# EAGLE schematic GTM900-breakout_v3 (EAGLE 7.7.0)
VERSION: v3
Assembly variants: default (no gps)

## Sheet 1 of 2
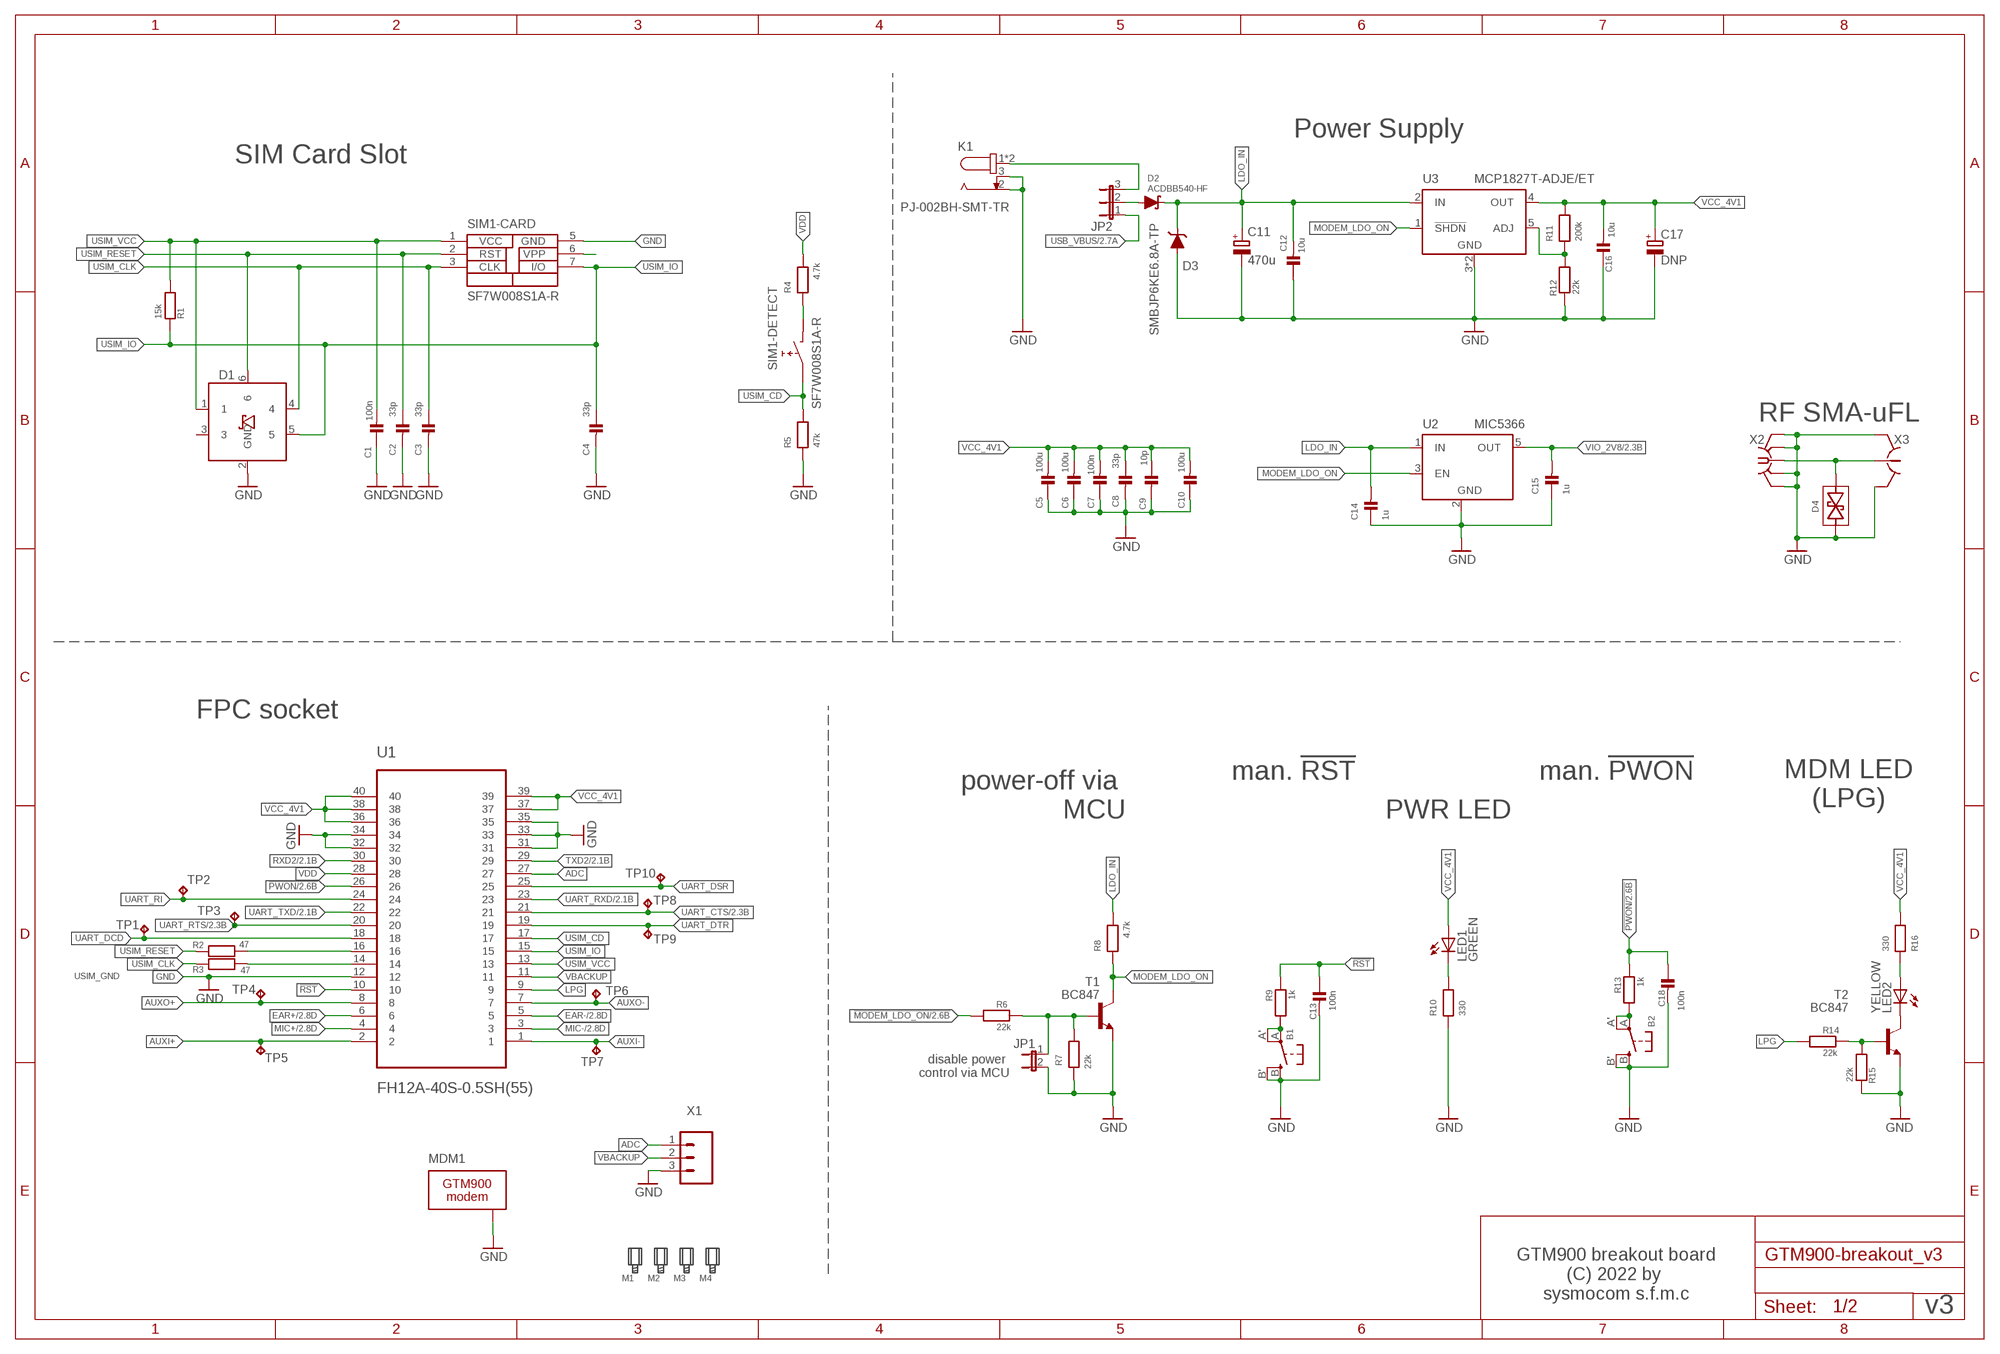
[diagram p0: schematic, sheet 1]
M1 (HEX-SPACER): CLASS: MECHANICAL; DESCRIPTION: RND STANDOFF M2X0.4 STEEL 3.5MM; LINK: https://www.digikey.de/product-detail/de/w%C3%BCrth-elektronik/9774035243R/732-7088-1-ND/; MANUFACTURER: Würth Elektronik; MANUFACTURERPARTNUMBER: 9774035243R; POPULATED: TRUE; ROHSCERTIFICATE: UNKNOWN ROHS CERTIFICATE; SCHEM_BOM_ITEM: TRUE; SOURCE: DIGIKEY; SOURCEPARTNUMBER: 732-7088-1-ND
M2 (HEX-SPACER): CLASS: MECHANICAL; DESCRIPTION: RND STANDOFF M2X0.4 STEEL 3.5MM; LINK: https://www.digikey.de/product-detail/de/w%C3%BCrth-elektronik/9774035243R/732-7088-1-ND/; MANUFACTURER: Würth Elektronik; MANUFACTURERPARTNUMBER: 9774035243R; POPULATED: TRUE; ROHSCERTIFICATE: UNKNOWN ROHS CERTIFICATE; SCHEM_BOM_ITEM: TRUE; SOURCE: DIGIKEY; SOURCEPARTNUMBER: 732-7088-1-ND
M3 (HEX-SPACER): CLASS: MECHANICAL; DESCRIPTION: RND STANDOFF M2X0.4 STEEL 3.5MM; LINK: https://www.digikey.de/product-detail/de/w%C3%BCrth-elektronik/9774035243R/732-7088-1-ND/; MANUFACTURER: Würth Elektronik; MANUFACTURERPARTNUMBER: 9774035243R; POPULATED: TRUE; ROHSCERTIFICATE: UNKNOWN ROHS CERTIFICATE; SCHEM_BOM_ITEM: TRUE; SOURCE: DIGIKEY; SOURCEPARTNUMBER: 732-7088-1-ND
M4 (HEX-SPACER): CLASS: MECHANICAL; DESCRIPTION: RND STANDOFF M2X0.4 STEEL 3.5MM; LINK: https://www.digikey.de/product-detail/de/w%C3%BCrth-elektronik/9774035243R/732-7088-1-ND/; MANUFACTURER: Würth Elektronik; MANUFACTURERPARTNUMBER: 9774035243R; POPULATED: TRUE; ROHSCERTIFICATE: UNKNOWN ROHS CERTIFICATE; SCHEM_BOM_ITEM: TRUE; SOURCE: DIGIKEY; SOURCEPARTNUMBER: 732-7088-1-ND

### Parts
B1  SWITCH_TACT_SMT  [EVQ-Q2]
B2  SWITCH_TACT_SMT  [EVQ-Q2]
C1  100n  CAP_CERAMIC_0603  [_0603]
C2  33p  CAP_CERAMIC_0402  [_0402]
C3  33p  CAP_CERAMIC_0402  [_0402]
C4  33p  CAP_CERAMIC_0402  [_0402]
C5  100u  CAP_CERAMIC1206  [1206]
C6  100u  CAP_CERAMIC1206  [1206]
C7  100n  CAP_CERAMIC_0603  [_0603]
C8  33p  CAP_CERAMIC_0402  [_0402]
C9  10p  CAP_CERAMIC_0603  [_0603]
C10  100u  CAP_CERAMIC1206  [1206]
C11  470u  CPOL-EUUD-8X10  [UD-8X10_NICHICON]
C12  10u  CAP_CERAMIC_0805  [_0805]
C13  100n  CAP_CERAMIC_0603  [_0603]
C14  1u  CAP_CERAMIC_0603  [_0603]
C15  1u  CAP_CERAMIC_0603  [_0603]
C16  10u  CAP_CERAMIC_0805  [_0805]
C17  DNP  CPOL-EUSMCE  [SMC_E]
C18  100n  CAP_CERAMIC_0603  [_0603]
D1  PESD5V0UBV  [SOT666]
D2  ACDBB540-HF  DIODE-SCHOTTKY-SMB  [SMBDIODE]
D3  SMBJP6KE6.8A-TP  DIODE-TVS-SMB  [SMBDIODE]
D4  GG040205170N2P  TVSDIODE-BIDI-0402  [_0402]
JP1  JP1E  [JP1]
JP2  JP2E  [JP2]
K1  PJ-002BH-SMT-TR  694108106102  [694108106102]
LED1  GREEN  LEDCHIP-LED0603  [CHIP-LED0603]
LED2  YELLOW  LEDCHIP-LED0603  [CHIP-LED0603]
MDM1  GTM900-BM2-SPACER  [GTM900-WRTHSPACER]
R1  15k  RESISTOR_0603  [_0603]
R2  47  RESISTOR_0603  [_0603]
R3  47  RESISTOR_0603  [_0603]
R4  4.7k  RESISTOR_0603  [_0603]
R5  47k  RESISTOR_0603  [_0603]
R6  22k  RESISTOR_0603  [_0603]
R7  22k  RESISTOR_0603  [_0603]
R8  4.7k  RESISTOR_0603  [_0603]
R9  1k  RESISTOR_0603  [_0603]
R10  330  RESISTOR_0603  [_0603]
R11  200k  RESISTOR_0603  [_0603]
R12  22k  RESISTOR_0603  [_0603]
R13  1k  RESISTOR_0603  [_0603]
R14  22k  RESISTOR_0603  [_0603]
R15  22k  RESISTOR_0603  [_0603]
R16  330  RESISTOR_0603  [_0603]
SIM1  SF7W008S1A-R  [SF7W008S1A-RESTR]
T1  BC847  BC847C-NPN-SOT23-BEC  [SOT23-BEC]
T2  BC847  BC847C-NPN-SOT23-BEC  [SOT23-BEC]
TP1  TPTP10R  [TP10R]
TP2  TPTP10R  [TP10R]
TP3  TPTP10R  [TP10R]
TP4  TPTP10R  [TP10R]
TP5  TPTP10R  [TP10R]
TP6  TPTP10R  [TP10R]
TP7  TPTP10R  [TP10R]
TP8  TPTP10R  [TP10R]
TP9  TPTP10R  [TP10R]
TP10  TPTP10R  [TP10R]
U1  FH12A-40S-0.5SH(55)  [HIROSE_FH12A-40S-0.5SH(55)]
U2  MIC5366  LDO_FIXED_EN-MIC5365-YC5  [SC70-5]
U3  MCP1827T-ADJE/ET  LDO_SHD_ADJMCP1827T-ADJE/ET  [TI_KTT_DPAK2]
X1  PINHD-1X3PTH  [1X03]
X2  SMA-F-S-TH  [SMA-F-S-TH]
X3  HRS_UFL  [HRS_UFL]

### Nets
!MODEM_LDO_ON: R6.1 ; also sheet 2
!PWON: C18.1 R13.1 U1.26 ; also sheet 2
!RST: C13.1 R9.1 U1.10
_USIM_CLK: R3.1 U1.14
_USIM_RESET: R2.1 U1.16
ADC: U1.27 X1.1
AUXI+: TP5.TP U1.2
AUXI-: TP7.TP U1.1
AUXO+: TP4.TP U1.8
AUXO-: TP6.TP U1.7
EAR+: U1.6 ; also sheet 2
EAR-: U1.5 ; also sheet 2
GND [supply]: B1.B'(S1) B1.B(S) B2.B'(S1) B2.B(S) C1.1 C2.2 C3.2 C4.2 C5.1 C6.1 C7.1 C8.2 C9.2 C10.1 C11.- C12.1 C13.2 C14.1 C15.1 C16.1 C17.- C18.2 D1.2(GND) D3.A D4.1 JP1.2 K1.2 K1.3 MDM1.1 MDM1.2 MDM1.3 MDM1.4 R5.1 R7.2 R10.1 R12.2 R15.2 SIM1.5(-CARD:GND) T1.E T2.E U1.12 U1.31 U1.32 U1.33 U1.34 U1.35 U2.2(GND) U3.3(GND) U3.PAD(GND) X1.3 X2.G1(GND) X2.G2(GND) X2.G3(GND) X2.G4(GND) X3.GND@1(GND) X3.GND@2(GND) ; also sheet 2
LDO_IN [supply]: C11.+ C12.2 C14.2 D2.C D3.C R8.2 U2.1(IN) U3.2(IN)
LPG: R14.1 U1.9
MIC+: U1.4 ; also sheet 2
MIC-: U1.3 ; also sheet 2
MODEM_LDO_ON: R8.1 T1.C U2.3(EN) U3.1(!SHDN)
N$1: LED1.C R10.2
N$2: LED2.A R16.2
N$3: LED2.C T2.C
N$4 [supply]: JP2.3 K1.1 K1.1-1
N$5: R14.2 R15.1 T2.B
N$6: R11.1 R12.1 U3.5(ADJ)
N$9: B2.A'(P1) B2.A(P) R13.2
N$10: R4.1 SIM1.82
N$13 [50 ohm]: D4.2 X2.C X3.SIG
N$17: JP1.1 R6.2 R7.1 T1.B
N$19 [supply]: D2.A JP2.2
N$21: B1.A'(P1) B1.A(P) R9.2
RXD2: U1.30 ; also sheet 2
TXD2: U1.29 ; also sheet 2
UART_CTS: TP8.TP U1.21 ; also sheet 2
UART_DCD: TP1.TP U1.18
UART_DSR: TP10.TP U1.25
UART_DTR: TP9.TP U1.19
UART_RI: TP2.TP U1.24
UART_RTS: TP3.TP U1.20 ; also sheet 2
UART_RXD: U1.23 ; also sheet 2
UART_TXD: U1.22 ; also sheet 2
USB_VBUS [supply]: JP2.1 ; also sheet 2
USIM_CD: R5.2 SIM1.81 U1.17
USIM_CLK: C3.1 D1.4 R3.2 SIM1.3(-CARD:CLK)
USIM_IO: C4.1 D1.5 R1.1 SIM1.7(-CARD:I/O) U1.15
USIM_RESET: C2.1 D1.6 R2.2 SIM1.2(-CARD:RST)
USIM_VCC [supply]: C1.2 D1.1 R1.2 SIM1.1(-CARD:VCC) U1.13
USIM_VPP: SIM1.6(-CARD:VPP)
VBACKUP: U1.11 X1.2
VCC_4V1 [supply]: C5.2 C6.2 C7.2 C8.1 C9.1 C10.2 C16.2 C17.+ LED1.A R11.2 R16.1 U1.36 U1.37 U1.38 U1.39 U1.40 U3.4(OUT)
VDD: R4.2 U1.28
VIO_2V8: C15.2 U2.5(OUT) ; also sheet 2
Unconnected: D1.3

### Notes on the sheet
- Power Supply
- SIM Card Slot
- RF SMA-uFL
- FPC socket
- power-off via 
  MCU
- man. !RST | man. !PWON
- MDM LED
  (LPG)
- PWR LED
- USIM_GND
- disable power 
  control via MCU
- GTM900 breakout board
  (C) 2022 by 
  sysmocom s.f.m.c

## Sheet 2 of 2
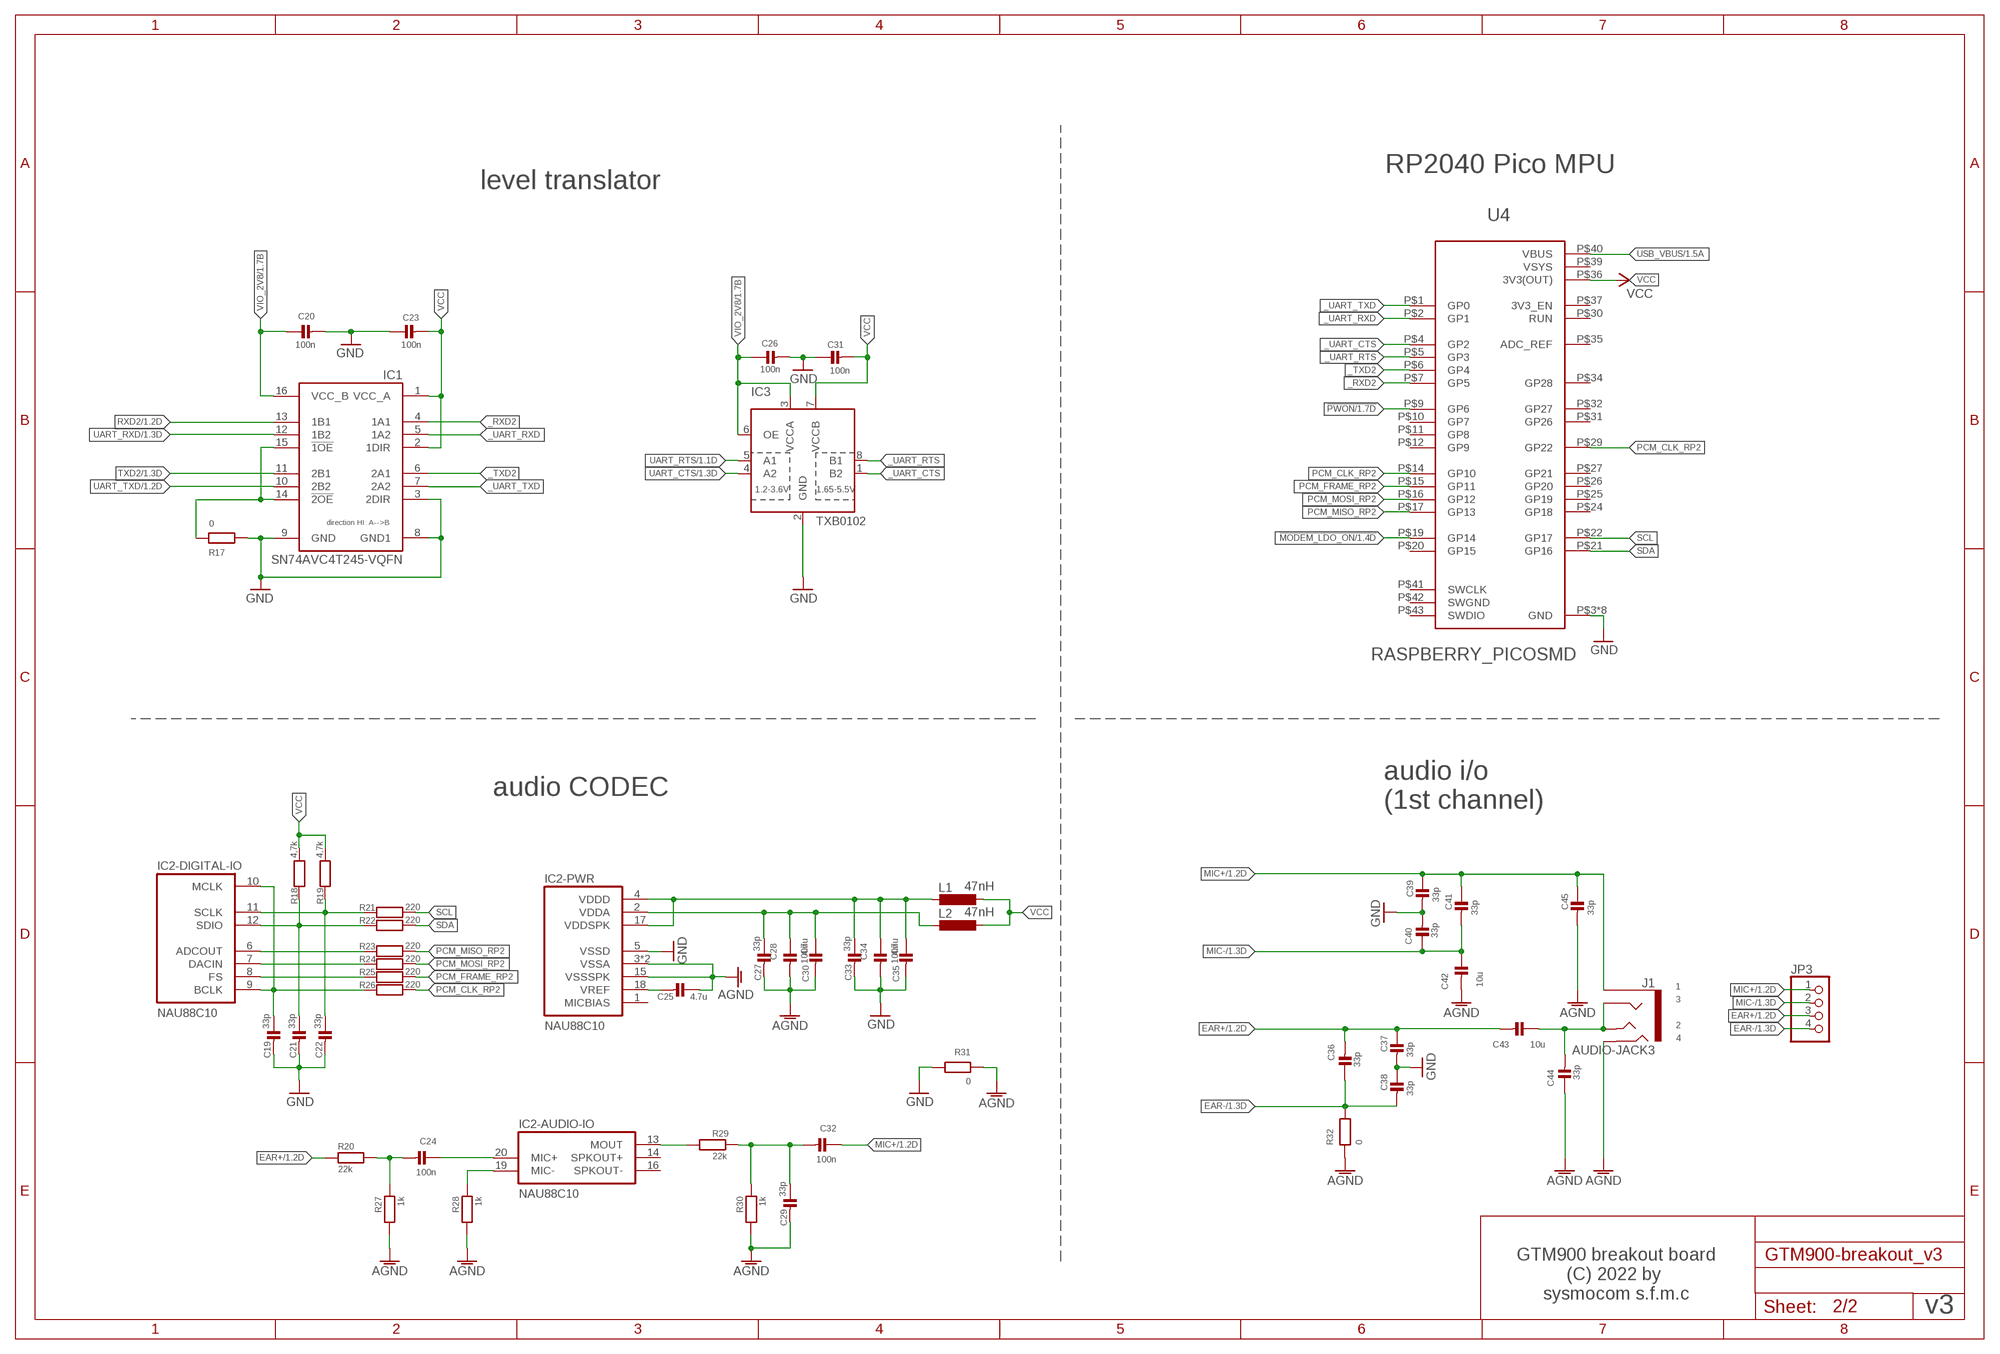
[diagram p1: schematic, sheet 2]

### Parts
C19  33p  CAP_CERAMIC_0402  [_0402]
C20  100n  CAP_CERAMIC_0603  [_0603]
C21  33p  CAP_CERAMIC_0402  [_0402]
C22  33p  CAP_CERAMIC_0402  [_0402]
C23  100n  CAP_CERAMIC_0603  [_0603]
C24  100n  CAP_CERAMIC_0603  [_0603]
C25  4.7u  CAP_CERAMIC_0603  [_0603]
C26  100n  CAP_CERAMIC_0603  [_0603]
C27  33p  CAP_CERAMIC_0402  [_0402]
C28  100n  CAP_CERAMIC_0603  [_0603]
C29  33p  CAP_CERAMIC_0402  [_0402]
C30  4.7u  CAP_CERAMIC_0603  [_0603]
C31  100n  CAP_CERAMIC_0603  [_0603]
C32  100n  CAP_CERAMIC_0603  [_0603]
C33  33p  CAP_CERAMIC_0402  [_0402]
C34  100n  CAP_CERAMIC_0603  [_0603]
C35  4.7u  CAP_CERAMIC_0603  [_0603]
C36  33p  CAP_CERAMIC_0402  [_0402]
C37  33p  CAP_CERAMIC_0402  [_0402]
C38  33p  CAP_CERAMIC_0402  [_0402]
C39  33p  CAP_CERAMIC_0402  [_0402]
C40  33p  CAP_CERAMIC_0402  [_0402]
C41  33p  CAP_CERAMIC_0402  [_0402]
C42  10u  CAP_CERAMIC_0805  [_0805]
C43  10u  CAP_CERAMIC_0805  [_0805]
C44  33p  CAP_CERAMIC_0402  [_0402]
C45  33p  CAP_CERAMIC_0402  [_0402]
IC1  SN74AVC4T245-VQFN  [VQFN-N16]
IC2  NAU88C10  [QFN20]
IC3  TXB0102  [VSSOP-8]
J1  AUDIO-JACK3  [AUDIO-JACK-TRRS-SMD]
JP3  HEADER-1X476MIL  [1X04_ROUND_76]
L1  47nH  INDUCTOR_0603  [_0603]
L2  47nH  INDUCTOR_0603  [_0603]
R17  0  RESISTOR_0603  [_0603]
R18  4,7k  RESISTOR_0603  [_0603]
R19  4,7k  RESISTOR_0603  [_0603]
R20  22k  RESISTOR_0603  [_0603]
R21  220  RESISTOR_0603  [_0603]
R22  220  RESISTOR_0603  [_0603]
R23  220  RESISTOR_0603  [_0603]
R24  220  RESISTOR_0603  [_0603]
R25  220  RESISTOR_0603  [_0603]
R26  220  RESISTOR_0603  [_0603]
R27  1k  RESISTOR_0603  [_0603]
R28  1k  RESISTOR_0603  [_0603]
R29  22k  RESISTOR_0603  [_0603]
R30  1k  RESISTOR_0603  [_0603]
R31  0  RESISTOR_0603  [_0603]
R32  0  RESISTOR_0603  [_0603]
U4  RASPBERRY_PICOSMD  [PICO-PKG-SMD]

### Nets
!MODEM_LDO_ON: U4.P$19(GP14) ; also sheet 1
!PWON: U4.P$9(GP6) ; also sheet 1
_RXD2: IC1.4(1A1) U4.P$7(GP5)
_TXD2: IC1.6(2A1) U4.P$6(GP4)
_UART_CTS: IC3.1(B2) U4.P$4(GP2)
_UART_RTS: IC3.8(B1) U4.P$5(GP3)
_UART_RXD: IC1.5(1A2) U4.P$2(GP1)
_UART_TXD: IC1.7(2A2) U4.P$1(GP0)
AGND: C25.1 C27.2 C28.2 C29.2 C30.2 C42.2 C44.1 C45.2 IC2.3(-PWR:VSSA) IC2.15(-PWR:VSSSPK) IC2.EXP(-PWR:VSSA) J1.4(RING2) R27.2 R28.2 R30.2 R31.1 R32.1
EAR+: C36.2 C37.1 C43.2 JP3.3 R20.1 ; also sheet 1
EAR-: C36.1 C38.2 JP3.4 R32.2 ; also sheet 1
GND [supply]: C19.2 C20.2 C21.2 C22.2 C23.1 C26.2 C31.1 C33.2 C34.2 C35.2 C37.2 C38.1 C39.2 C40.2 IC1.3(2DIR) IC1.8(GND1) IC1.9(GND) IC2.5(-PWR:VSSD) IC3.2(GND) R17.2 R31.2 U4.P$3(GND) U4.P$8(GND) U4.P$13(GND) U4.P$18(GND) U4.P$23(GND) U4.P$28(GND) U4.P$33(GND) U4.P$38(GND) ; also sheet 1
MIC+: C32.1 C39.1 C41.1 C45.1 J1.1(EARTH) JP3.1 ; also sheet 1
MIC-: C40.1 C41.2 C42.1 JP3.2 ; also sheet 1
N$7: C24.2 R20.2 R27.1
N$8: C43.1 C44.2 J1.2(TIP) J1.3(RING1)
N$11: C19.1 IC2.9(-DIGITAL-IO:BCLK) IC2.10(-DIGITAL-IO:MCLK) R26.1
N$12: IC2.8(-DIGITAL-IO:FS) R25.1
N$14: IC2.7(-DIGITAL-IO:DACIN) R24.1
N$15: IC2.6(-DIGITAL-IO:ADCOUT) R23.1
N$16: C29.1 C32.2 R29.2 R30.1
N$18: IC2.19(-AUDIO-IO:MIC-) R28.1
N$20: C33.1 C34.1 C35.1 IC2.4(-PWR:VDDD) IC2.17(-PWR:VDDSPK) L1.2
N$22 [supply]: IC1.14(!2OE) IC1.15(!1OE) R17.1
N$24: C27.1 C28.1 C30.1 IC2.2(-PWR:VDDA) L2.2
N$25: C21.1 IC2.12(-DIGITAL-IO:SDIO) R18.1 R22.1
N$26: C22.1 IC2.11(-DIGITAL-IO:SCLK) R19.1 R21.1
N$28: C25.2 IC2.18(-PWR:VREF)
N$30: IC2.13(-AUDIO-IO:MOUT) R29.1
N$31: C24.1 IC2.20(-AUDIO-IO:MIC+)
PCM_CLK_RP2: R26.2 U4.P$14(GP10) U4.P$29(GP22)
PCM_FRAME_RP2: R25.2 U4.P$15(GP11)
PCM_MISO_RP2: R23.2 U4.P$17(GP13)
PCM_MOSI_RP2: R24.2 U4.P$16(GP12)
RXD2: IC1.13(1B1) ; also sheet 1
SCL: R21.2 U4.P$22(GP17)
SDA: R22.2 U4.P$21(GP16)
TXD2: IC1.11(2B1) ; also sheet 1
UART_CTS: IC3.4(A2) ; also sheet 1
UART_RTS: IC3.5(A1) ; also sheet 1
UART_RXD: IC1.12(1B2) ; also sheet 1
UART_TXD: IC1.10(2B2) ; also sheet 1
USB_VBUS [supply]: U4.P$40(VBUS) ; also sheet 1
VCC: C23.2 C31.2 IC1.1(VCC_A) IC1.2(1DIR) IC3.7(VCCB) L1.1 L2.1 R18.2 R19.2 U4.P$36(3V3(OUT))
VIO_2V8: C20.1 C26.1 IC1.16(VCC_B) IC3.3(VCCA) IC3.6(OE) ; also sheet 1
Unconnected: U4.P$10(GP7) U4.P$11(GP8) U4.P$12(GP9) U4.P$20(GP15) U4.P$24(GP18) U4.P$25(GP19) U4.P$26(GP20) U4.P$27(GP21) U4.P$30(RUN) U4.P$31(GP26) U4.P$32(GP27) U4.P$34(GP28) U4.P$35(ADC_REF) U4.P$37(3V3_EN) U4.P$41(SWCLK) U4.P$43(SWDIO)

### Notes on the sheet
- RP2040 Pico MPU
- level translator
- audio CODEC
- audio i/o 
  (1st channel)
- GTM900 breakout board
  (C) 2022 by 
  sysmocom s.f.m.c

## Power pins joined to a net without a drawn wire
MICBIAS: IC2.1(-PWR:MICBIAS)
SPKOUT+: IC2.14(-AUDIO-IO:SPKOUT+)
SPKOUT-: IC2.16(-AUDIO-IO:SPKOUT-)
SWGND: U4.P$42(SWGND)
VSYS: U4.P$39(VSYS)

## Library data of the parts
B1 B2 = microbuilder:SWITCH_TACT_SMT: SMT Tact Switches 6x6mm - Digikey: P12940SCT-ND KMR2 (4.6x2.8mm) - Digikey: 401-1426-1-ND EVQ-PQHB55 - Light Touch, 160GF (4.5x4.5mm) - Digikey: P8090SCT-ND; CLASS: TACT SWITCH; DESCRIPTION: SWITCH TACTILE SPST-NO 0.02A 15V; LINK: https://www.digikey.de/product-detail/de/panasonic-electronic-components/EVQ-Q2M03W/P12946SCT-ND; MANUFACTURER: Panasonic Electronic Components; MANUFACTURERPARTNUMBER: EVQ-Q2M03W; POPULATED: TRUE; ROHSCERTIFICATE: UNKNOWN ROHS CERTIFICATE; SOURCE: DIGIKEY; SOURCEPARTNUMBER: P12946SCT-ND
C1 C7 C13 C18 = rc-sysmocom:CAP_CERAMIC: Ceramic Capacitors 0402 - 0402 Surface Mount Capacitors 16pF 50V 5% [Digikey: 445-4899-2-ND] 18pF 50V 5% [Digikey: 490-1281-2-ND] 22pF 50V 5% [Digikey: 490-1283-2-ND] 68pF 50V 5% [Digikey: 490-1289-2-ND] 0.1uF 10V 10% [Digikey: 490-1318-2-ND] 1.0uF 6.3V 10% [Digikey: 490-1320-2-ND] 0603 - 0603 Surface Mount Capacitors 16 pF 50V 5% [Digikey: 445-5051-2-ND] 22 pF 50V [Digikey: PCC220ACVTR-ND] 33 pF 50V 5% [Digikey: 490-1415-1-ND] 56pF 50V 5% [Digikey: 490-1421-1-ND] 220pF 50V 5% [Digikey: 445-1285-1-ND] 680 pF 50V 2200 pF 50V 5% C0G [Digikey: 445-1297-1-ND] 5600 pF 100V 5% X7R [Digikey: 478-3711-1-ND] 0.1 µF 25V 10% [Digikey: PCC2277TR-ND] 0.22 µF 16V 10% X7R [Digikey: 445-1318-1-ND] 1.0 µF 25V 10% [Digikey: 445-5146-2-ND] 0603 - RF Specific 3pF 250V +/-0.1pF RF [Digikey: 712-1347-1-ND] 18 pF 250V 5% [Digikey: 478-3505-1-ND or 712-1322-1-ND] 56 pF 250V 5% C0G RF [Digikey: 490-4867-1-ND] 68 pF 250V RF [Digikey: 490-4868-1-ND] 0805 - 0805 Surface Mount Capacitors 220 pF 250V 2% RF Ceramic Capacitor [Digikey: 712-1398-1-ND] 1000 pF 50V 2% NP0 Ceramic Capacitor [Digikey: 478-3760-1-ND] 0.1 µF 25V 10% Ceramic Capacitor [Digikey: PCC1828TR-ND] 1.0 µF 16V 10% Ceramic Capacitor[Digikey: 490-1691-2-ND] 10.0 µF 10V 10% Ceramic Capacitor[Digikey: 709-1228-1-ND] 10.0 uF 16V 10% Ceramic Capacitor [Digikey: 478-5165-2-ND] 47 uF 6.3V 20% Ceramic Capacitor [Digikey: 587-1779-1-ND or 399-5506-1-ND] 1206 - 1206 Surface Mount Capacitors 47uF 10V 20% Ceramic Capacitor [Digikey: 490-5528-1-ND or 399-5508-1-ND or 445-6010-1-ND] 100uF 6.3V -20%, +80% Y5V Ceramic Capacitor (Digikey: 490-4512-1-ND, Mouser: 81-GRM31CF50J107ZE1L) 1810 - 1810 Surface Mount Capacitors High volt MLC; no solder stop between for higher isolation; CLASS: CAPACITOR; DESCRIPTION: CAP CER 0.1UF 16V 10% X7R 0603; LINK: http://www.digikey.de/product-detail/de/foo/1276-1005-1-ND; MANUFACTURER: Samsung Electro-Mechanics America, Inc; MANUFACTURERPARTNUMBER: CL10B104KO8NNNC; POPULATED: TRUE; ROHSCERTIFICATE: Bleifrei / RoHS-konform; SOURCE: DIGIKEY; SOURCEPARTNUMBER: 1276-1005-1-ND
C2-C4 C8 C19 C21 C22 C27 C29 C33 C36-C41 C44 C45 = rc-sysmocom:CAP_CERAMIC: Ceramic Capacitors 0402 - 0402 Surface Mount Capacitors 16pF 50V 5% [Digikey: 445-4899-2-ND] 18pF 50V 5% [Digikey: 490-1281-2-ND] 22pF 50V 5% [Digikey: 490-1283-2-ND] 68pF 50V 5% [Digikey: 490-1289-2-ND] 0.1uF 10V 10% [Digikey: 490-1318-2-ND] 1.0uF 6.3V 10% [Digikey: 490-1320-2-ND] 0603 - 0603 Surface Mount Capacitors 16 pF 50V 5% [Digikey: 445-5051-2-ND] 22 pF 50V [Digikey: PCC220ACVTR-ND] 33 pF 50V 5% [Digikey: 490-1415-1-ND] 56pF 50V 5% [Digikey: 490-1421-1-ND] 220pF 50V 5% [Digikey: 445-1285-1-ND] 680 pF 50V 2200 pF 50V 5% C0G [Digikey: 445-1297-1-ND] 5600 pF 100V 5% X7R [Digikey: 478-3711-1-ND] 0.1 µF 25V 10% [Digikey: PCC2277TR-ND] 0.22 µF 16V 10% X7R [Digikey: 445-1318-1-ND] 1.0 µF 25V 10% [Digikey: 445-5146-2-ND] 0603 - RF Specific 3pF 250V +/-0.1pF RF [Digikey: 712-1347-1-ND] 18 pF 250V 5% [Digikey: 478-3505-1-ND or 712-1322-1-ND] 56 pF 250V 5% C0G RF [Digikey: 490-4867-1-ND] 68 pF 250V RF [Digikey: 490-4868-1-ND] 0805 - 0805 Surface Mount Capacitors 220 pF 250V 2% RF Ceramic Capacitor [Digikey: 712-1398-1-ND] 1000 pF 50V 2% NP0 Ceramic Capacitor [Digikey: 478-3760-1-ND] 0.1 µF 25V 10% Ceramic Capacitor [Digikey: PCC1828TR-ND] 1.0 µF 16V 10% Ceramic Capacitor[Digikey: 490-1691-2-ND] 10.0 µF 10V 10% Ceramic Capacitor[Digikey: 709-1228-1-ND] 10.0 uF 16V 10% Ceramic Capacitor [Digikey: 478-5165-2-ND] 47 uF 6.3V 20% Ceramic Capacitor [Digikey: 587-1779-1-ND or 399-5506-1-ND] 1206 - 1206 Surface Mount Capacitors 47uF 10V 20% Ceramic Capacitor [Digikey: 490-5528-1-ND or 399-5508-1-ND or 445-6010-1-ND] 100uF 6.3V -20%, +80% Y5V Ceramic Capacitor (Digikey: 490-4512-1-ND, Mouser: 81-GRM31CF50J107ZE1L) 1810 - 1810 Surface Mount Capacitors High volt MLC; no solder stop between for higher isolation; CLASS: CAPACITOR; DESCRIPTION: CAP CER 33PF 50V NP0 0402; LINK: http://www.digikey.de/product-detail/de/CL05C330JB5NNNC/1276-1272-1-ND/3889358; MANUFACTURER: Samsung Electro-Mechanics America, Inc.; MANUFACTURERPARTNUMBER: CL05C330JB5NNNC; POPULATED: TRUE; ROHSCERTIFICATE: Bleifrei / RoHS-konform; SOURCE: DIGIKEY; SOURCEPARTNUMBER: 1276-1272-1-ND
C5 C6 C10 = rc-sysmocom:CAP_CERAMIC: Ceramic Capacitors 0402 - 0402 Surface Mount Capacitors 16pF 50V 5% [Digikey: 445-4899-2-ND] 18pF 50V 5% [Digikey: 490-1281-2-ND] 22pF 50V 5% [Digikey: 490-1283-2-ND] 68pF 50V 5% [Digikey: 490-1289-2-ND] 0.1uF 10V 10% [Digikey: 490-1318-2-ND] 1.0uF 6.3V 10% [Digikey: 490-1320-2-ND] 0603 - 0603 Surface Mount Capacitors 16 pF 50V 5% [Digikey: 445-5051-2-ND] 22 pF 50V [Digikey: PCC220ACVTR-ND] 33 pF 50V 5% [Digikey: 490-1415-1-ND] 56pF 50V 5% [Digikey: 490-1421-1-ND] 220pF 50V 5% [Digikey: 445-1285-1-ND] 680 pF 50V 2200 pF 50V 5% C0G [Digikey: 445-1297-1-ND] 5600 pF 100V 5% X7R [Digikey: 478-3711-1-ND] 0.1 µF 25V 10% [Digikey: PCC2277TR-ND] 0.22 µF 16V 10% X7R [Digikey: 445-1318-1-ND] 1.0 µF 25V 10% [Digikey: 445-5146-2-ND] 0603 - RF Specific 3pF 250V +/-0.1pF RF [Digikey: 712-1347-1-ND] 18 pF 250V 5% [Digikey: 478-3505-1-ND or 712-1322-1-ND] 56 pF 250V 5% C0G RF [Digikey: 490-4867-1-ND] 68 pF 250V RF [Digikey: 490-4868-1-ND] 0805 - 0805 Surface Mount Capacitors 220 pF 250V 2% RF Ceramic Capacitor [Digikey: 712-1398-1-ND] 1000 pF 50V 2% NP0 Ceramic Capacitor [Digikey: 478-3760-1-ND] 0.1 µF 25V 10% Ceramic Capacitor [Digikey: PCC1828TR-ND] 1.0 µF 16V 10% Ceramic Capacitor[Digikey: 490-1691-2-ND] 10.0 µF 10V 10% Ceramic Capacitor[Digikey: 709-1228-1-ND] 10.0 uF 16V 10% Ceramic Capacitor [Digikey: 478-5165-2-ND] 47 uF 6.3V 20% Ceramic Capacitor [Digikey: 587-1779-1-ND or 399-5506-1-ND] 1206 - 1206 Surface Mount Capacitors 47uF 10V 20% Ceramic Capacitor [Digikey: 490-5528-1-ND or 399-5508-1-ND or 445-6010-1-ND] 100uF 6.3V -20%, +80% Y5V Ceramic Capacitor (Digikey: 490-4512-1-ND, Mouser: 81-GRM31CF50J107ZE1L) 1810 - 1810 Surface Mount Capacitors High volt MLC; no solder stop between for higher isolation; CLASS: CAPACITOR; DESCRIPTION: CAP CER 100UF 6.3V X5R 1206; LINK: http://www.digikey.de/product-detail/de/murata-electronics-north-america/GRM31CR60J107ME39K/490-7217-1-ND/3991203; MANUFACTURER: Murata Electronics; MANUFACTURERPARTNUMBER: GRM31CR60J107ME39K; POPULATED: TRUE; ROHSCERTIFICATE: UNKNOWN ROHS CERTIFICATE; SOURCE: DIGIKEY; SOURCEPARTNUMBER: 490-7217-1-ND
C9 = rc-sysmocom:CAP_CERAMIC: Ceramic Capacitors 0402 - 0402 Surface Mount Capacitors 16pF 50V 5% [Digikey: 445-4899-2-ND] 18pF 50V 5% [Digikey: 490-1281-2-ND] 22pF 50V 5% [Digikey: 490-1283-2-ND] 68pF 50V 5% [Digikey: 490-1289-2-ND] 0.1uF 10V 10% [Digikey: 490-1318-2-ND] 1.0uF 6.3V 10% [Digikey: 490-1320-2-ND] 0603 - 0603 Surface Mount Capacitors 16 pF 50V 5% [Digikey: 445-5051-2-ND] 22 pF 50V [Digikey: PCC220ACVTR-ND] 33 pF 50V 5% [Digikey: 490-1415-1-ND] 56pF 50V 5% [Digikey: 490-1421-1-ND] 220pF 50V 5% [Digikey: 445-1285-1-ND] 680 pF 50V 2200 pF 50V 5% C0G [Digikey: 445-1297-1-ND] 5600 pF 100V 5% X7R [Digikey: 478-3711-1-ND] 0.1 µF 25V 10% [Digikey: PCC2277TR-ND] 0.22 µF 16V 10% X7R [Digikey: 445-1318-1-ND] 1.0 µF 25V 10% [Digikey: 445-5146-2-ND] 0603 - RF Specific 3pF 250V +/-0.1pF RF [Digikey: 712-1347-1-ND] 18 pF 250V 5% [Digikey: 478-3505-1-ND or 712-1322-1-ND] 56 pF 250V 5% C0G RF [Digikey: 490-4867-1-ND] 68 pF 250V RF [Digikey: 490-4868-1-ND] 0805 - 0805 Surface Mount Capacitors 220 pF 250V 2% RF Ceramic Capacitor [Digikey: 712-1398-1-ND] 1000 pF 50V 2% NP0 Ceramic Capacitor [Digikey: 478-3760-1-ND] 0.1 µF 25V 10% Ceramic Capacitor [Digikey: PCC1828TR-ND] 1.0 µF 16V 10% Ceramic Capacitor[Digikey: 490-1691-2-ND] 10.0 µF 10V 10% Ceramic Capacitor[Digikey: 709-1228-1-ND] 10.0 uF 16V 10% Ceramic Capacitor [Digikey: 478-5165-2-ND] 47 uF 6.3V 20% Ceramic Capacitor [Digikey: 587-1779-1-ND or 399-5506-1-ND] 1206 - 1206 Surface Mount Capacitors 47uF 10V 20% Ceramic Capacitor [Digikey: 490-5528-1-ND or 399-5508-1-ND or 445-6010-1-ND] 100uF 6.3V -20%, +80% Y5V Ceramic Capacitor (Digikey: 490-4512-1-ND, Mouser: 81-GRM31CF50J107ZE1L) 1810 - 1810 Surface Mount Capacitors High volt MLC; no solder stop between for higher isolation; CLASS: CAPACITOR; DESCRIPTION: CAP CER 10PF 50V NP0 0603; LINK: http://www.digikey.de/product-detail/de/C0603C100J5GACTU/399-1049-1-ND; MANUFACTURER: Kemet; MANUFACTURERPARTNUMBER: C0603C100J5GACTU; POPULATED: TRUE; ROHSCERTIFICATE: Bleifrei / RoHS-konform; SOURCE: DIGIKEY; SOURCEPARTNUMBER: 399-1049-1-ND
C11 = rcl:CPOL-EU: POLARIZED CAPACITOR, European symbol; CLASS: CAPACITOR; DESCRIPTION: CAP ALUM 470UF 20%% 6.3V SMD; LINK: http://www.digikey.de/product-detail/de/nichicon/UUR0J471MNL1GS/493-6207-1-ND/3438720; MANUFACTURER: Nichicon; MANUFACTURERPARTNUMBER: UUR0J471MNL1GS; POPULATED: TRUE; ROHSCERTIFICATE: UNKNOWN ROHS CERTIFICATE; SOURCE: DIGIKEY; SOURCEPARTNUMBER: 493-6207-1-ND
C12 C16 C42 C43 = rc-sysmocom:CAP_CERAMIC: Ceramic Capacitors 0402 - 0402 Surface Mount Capacitors 16pF 50V 5% [Digikey: 445-4899-2-ND] 18pF 50V 5% [Digikey: 490-1281-2-ND] 22pF 50V 5% [Digikey: 490-1283-2-ND] 68pF 50V 5% [Digikey: 490-1289-2-ND] 0.1uF 10V 10% [Digikey: 490-1318-2-ND] 1.0uF 6.3V 10% [Digikey: 490-1320-2-ND] 0603 - 0603 Surface Mount Capacitors 16 pF 50V 5% [Digikey: 445-5051-2-ND] 22 pF 50V [Digikey: PCC220ACVTR-ND] 33 pF 50V 5% [Digikey: 490-1415-1-ND] 56pF 50V 5% [Digikey: 490-1421-1-ND] 220pF 50V 5% [Digikey: 445-1285-1-ND] 680 pF 50V 2200 pF 50V 5% C0G [Digikey: 445-1297-1-ND] 5600 pF 100V 5% X7R [Digikey: 478-3711-1-ND] 0.1 µF 25V 10% [Digikey: PCC2277TR-ND] 0.22 µF 16V 10% X7R [Digikey: 445-1318-1-ND] 1.0 µF 25V 10% [Digikey: 445-5146-2-ND] 0603 - RF Specific 3pF 250V +/-0.1pF RF [Digikey: 712-1347-1-ND] 18 pF 250V 5% [Digikey: 478-3505-1-ND or 712-1322-1-ND] 56 pF 250V 5% C0G RF [Digikey: 490-4867-1-ND] 68 pF 250V RF [Digikey: 490-4868-1-ND] 0805 - 0805 Surface Mount Capacitors 220 pF 250V 2% RF Ceramic Capacitor [Digikey: 712-1398-1-ND] 1000 pF 50V 2% NP0 Ceramic Capacitor [Digikey: 478-3760-1-ND] 0.1 µF 25V 10% Ceramic Capacitor [Digikey: PCC1828TR-ND] 1.0 µF 16V 10% Ceramic Capacitor[Digikey: 490-1691-2-ND] 10.0 µF 10V 10% Ceramic Capacitor[Digikey: 709-1228-1-ND] 10.0 uF 16V 10% Ceramic Capacitor [Digikey: 478-5165-2-ND] 47 uF 6.3V 20% Ceramic Capacitor [Digikey: 587-1779-1-ND or 399-5506-1-ND] 1206 - 1206 Surface Mount Capacitors 47uF 10V 20% Ceramic Capacitor [Digikey: 490-5528-1-ND or 399-5508-1-ND or 445-6010-1-ND] 100uF 6.3V -20%, +80% Y5V Ceramic Capacitor (Digikey: 490-4512-1-ND, Mouser: 81-GRM31CF50J107ZE1L) 1810 - 1810 Surface Mount Capacitors High volt MLC; no solder stop between for higher isolation; CLASS: CAPACITOR; DESCRIPTION: CAP CER 10UF 16V X5R 0805; LINK: https://www.digikey.de/product-detail/de/murata-electronics/GRM21BR61C106KE15K/490-6473-1-ND; MANUFACTURER: Murata Electronics; MANUFACTURERPARTNUMBER: GRM21BR61C106KE15K; POPULATED: TRUE; ROHSCERTIFICATE: UNKNOWN ROHS CERTIFICATE; SOURCE: DIGIKEY; SOURCEPARTNUMBER: 490-6473-1-ND
C14 C15 = rc-sysmocom:CAP_CERAMIC: Ceramic Capacitors 0402 - 0402 Surface Mount Capacitors 16pF 50V 5% [Digikey: 445-4899-2-ND] 18pF 50V 5% [Digikey: 490-1281-2-ND] 22pF 50V 5% [Digikey: 490-1283-2-ND] 68pF 50V 5% [Digikey: 490-1289-2-ND] 0.1uF 10V 10% [Digikey: 490-1318-2-ND] 1.0uF 6.3V 10% [Digikey: 490-1320-2-ND] 0603 - 0603 Surface Mount Capacitors 16 pF 50V 5% [Digikey: 445-5051-2-ND] 22 pF 50V [Digikey: PCC220ACVTR-ND] 33 pF 50V 5% [Digikey: 490-1415-1-ND] 56pF 50V 5% [Digikey: 490-1421-1-ND] 220pF 50V 5% [Digikey: 445-1285-1-ND] 680 pF 50V 2200 pF 50V 5% C0G [Digikey: 445-1297-1-ND] 5600 pF 100V 5% X7R [Digikey: 478-3711-1-ND] 0.1 µF 25V 10% [Digikey: PCC2277TR-ND] 0.22 µF 16V 10% X7R [Digikey: 445-1318-1-ND] 1.0 µF 25V 10% [Digikey: 445-5146-2-ND] 0603 - RF Specific 3pF 250V +/-0.1pF RF [Digikey: 712-1347-1-ND] 18 pF 250V 5% [Digikey: 478-3505-1-ND or 712-1322-1-ND] 56 pF 250V 5% C0G RF [Digikey: 490-4867-1-ND] 68 pF 250V RF [Digikey: 490-4868-1-ND] 0805 - 0805 Surface Mount Capacitors 220 pF 250V 2% RF Ceramic Capacitor [Digikey: 712-1398-1-ND] 1000 pF 50V 2% NP0 Ceramic Capacitor [Digikey: 478-3760-1-ND] 0.1 µF 25V 10% Ceramic Capacitor [Digikey: PCC1828TR-ND] 1.0 µF 16V 10% Ceramic Capacitor[Digikey: 490-1691-2-ND] 10.0 µF 10V 10% Ceramic Capacitor[Digikey: 709-1228-1-ND] 10.0 uF 16V 10% Ceramic Capacitor [Digikey: 478-5165-2-ND] 47 uF 6.3V 20% Ceramic Capacitor [Digikey: 587-1779-1-ND or 399-5506-1-ND] 1206 - 1206 Surface Mount Capacitors 47uF 10V 20% Ceramic Capacitor [Digikey: 490-5528-1-ND or 399-5508-1-ND or 445-6010-1-ND] 100uF 6.3V -20%, +80% Y5V Ceramic Capacitor (Digikey: 490-4512-1-ND, Mouser: 81-GRM31CF50J107ZE1L) 1810 - 1810 Surface Mount Capacitors High volt MLC; no solder stop between for higher isolation; CLASS: CAPACITOR; DESCRIPTION: CAP CER 1UF 16V X5R 0603; LINK: https://www.digikey.de/product-detail/de/samsung-electro-mechanics/CL10A105KO8NNNC/1276-1034-1-ND/; MANUFACTURER: Samsung Electro-Mechanics; MANUFACTURERPARTNUMBER: CL10A105KO8NNNC; POPULATED: TRUE; ROHSCERTIFICATE: UNKNOWN ROHS CERTIFICATE; SOURCE: DIGIKEY; SOURCEPARTNUMBER: 1276-1034-1-ND
C17 = rcl:CPOL-EU: POLARIZED CAPACITOR, European symbol; CLASS: CAPACITOR; DESCRIPTION: NO DESCRIPTION; LINK: UNKNOWN LINK; MANUFACTURER: UNKNOWN MANUFACTURER; MANUFACTURERPARTNUMBER: UNKNOWN MANUFACTURER PART NUMBER; POPULATED: FALSE; ROHSCERTIFICATE: UNKNOWN ROHS CERTIFICATE; SOURCE: UNKNOWN SOURCE; SOURCEPARTNUMBER: UNKNOWN SOURCE PART NUMBER
C20 C23 C24 C26 C28 C31 C32 C34 = rc-sysmocom:CAP_CERAMIC: Ceramic Capacitors 0402 - 0402 Surface Mount Capacitors 16pF 50V 5% [Digikey: 445-4899-2-ND] 18pF 50V 5% [Digikey: 490-1281-2-ND] 22pF 50V 5% [Digikey: 490-1283-2-ND] 68pF 50V 5% [Digikey: 490-1289-2-ND] 0.1uF 10V 10% [Digikey: 490-1318-2-ND] 1.0uF 6.3V 10% [Digikey: 490-1320-2-ND] 0603 - 0603 Surface Mount Capacitors 16 pF 50V 5% [Digikey: 445-5051-2-ND] 22 pF 50V [Digikey: PCC220ACVTR-ND] 33 pF 50V 5% [Digikey: 490-1415-1-ND] 56pF 50V 5% [Digikey: 490-1421-1-ND] 220pF 50V 5% [Digikey: 445-1285-1-ND] 680 pF 50V 2200 pF 50V 5% C0G [Digikey: 445-1297-1-ND] 5600 pF 100V 5% X7R [Digikey: 478-3711-1-ND] 0.1 µF 25V 10% [Digikey: PCC2277TR-ND] 0.22 µF 16V 10% X7R [Digikey: 445-1318-1-ND] 1.0 µF 25V 10% [Digikey: 445-5146-2-ND] 0603 - RF Specific 3pF 250V +/-0.1pF RF [Digikey: 712-1347-1-ND] 18 pF 250V 5% [Digikey: 478-3505-1-ND or 712-1322-1-ND] 56 pF 250V 5% C0G RF [Digikey: 490-4867-1-ND] 68 pF 250V RF [Digikey: 490-4868-1-ND] 0805 - 0805 Surface Mount Capacitors 220 pF 250V 2% RF Ceramic Capacitor [Digikey: 712-1398-1-ND] 1000 pF 50V 2% NP0 Ceramic Capacitor [Digikey: 478-3760-1-ND] 0.1 µF 25V 10% Ceramic Capacitor [Digikey: PCC1828TR-ND] 1.0 µF 16V 10% Ceramic Capacitor[Digikey: 490-1691-2-ND] 10.0 µF 10V 10% Ceramic Capacitor[Digikey: 709-1228-1-ND] 10.0 uF 16V 10% Ceramic Capacitor [Digikey: 478-5165-2-ND] 47 uF 6.3V 20% Ceramic Capacitor [Digikey: 587-1779-1-ND or 399-5506-1-ND] 1206 - 1206 Surface Mount Capacitors 47uF 10V 20% Ceramic Capacitor [Digikey: 490-5528-1-ND or 399-5508-1-ND or 445-6010-1-ND] 100uF 6.3V -20%, +80% Y5V Ceramic Capacitor (Digikey: 490-4512-1-ND, Mouser: 81-GRM31CF50J107ZE1L) 1810 - 1810 Surface Mount Capacitors High volt MLC; no solder stop between for higher isolation; CLASS: CAPACITOR; DESCRIPTION: CAP CER 0.1UF 16V X5R 0201; LINK: http://www.digikey.de/product-detail/de/murata-electronics-north-america/GRM033R61C104KE84D/490-9985-1-ND/5026290; MANUFACTURER: Murata Electronics; MANUFACTURERPARTNUMBER: GRM033R61C104KE84D; POPULATED: TRUE; ROHSCERTIFICATE: UNKNOWN ROHS CERTIFICATE; SOURCE: DIGIKEY; SOURCEPARTNUMBER: 490-9985-1-ND
C25 C30 C35 = rc-sysmocom:CAP_CERAMIC: Ceramic Capacitors 0402 - 0402 Surface Mount Capacitors 16pF 50V 5% [Digikey: 445-4899-2-ND] 18pF 50V 5% [Digikey: 490-1281-2-ND] 22pF 50V 5% [Digikey: 490-1283-2-ND] 68pF 50V 5% [Digikey: 490-1289-2-ND] 0.1uF 10V 10% [Digikey: 490-1318-2-ND] 1.0uF 6.3V 10% [Digikey: 490-1320-2-ND] 0603 - 0603 Surface Mount Capacitors 16 pF 50V 5% [Digikey: 445-5051-2-ND] 22 pF 50V [Digikey: PCC220ACVTR-ND] 33 pF 50V 5% [Digikey: 490-1415-1-ND] 56pF 50V 5% [Digikey: 490-1421-1-ND] 220pF 50V 5% [Digikey: 445-1285-1-ND] 680 pF 50V 2200 pF 50V 5% C0G [Digikey: 445-1297-1-ND] 5600 pF 100V 5% X7R [Digikey: 478-3711-1-ND] 0.1 µF 25V 10% [Digikey: PCC2277TR-ND] 0.22 µF 16V 10% X7R [Digikey: 445-1318-1-ND] 1.0 µF 25V 10% [Digikey: 445-5146-2-ND] 0603 - RF Specific 3pF 250V +/-0.1pF RF [Digikey: 712-1347-1-ND] 18 pF 250V 5% [Digikey: 478-3505-1-ND or 712-1322-1-ND] 56 pF 250V 5% C0G RF [Digikey: 490-4867-1-ND] 68 pF 250V RF [Digikey: 490-4868-1-ND] 0805 - 0805 Surface Mount Capacitors 220 pF 250V 2% RF Ceramic Capacitor [Digikey: 712-1398-1-ND] 1000 pF 50V 2% NP0 Ceramic Capacitor [Digikey: 478-3760-1-ND] 0.1 µF 25V 10% Ceramic Capacitor [Digikey: PCC1828TR-ND] 1.0 µF 16V 10% Ceramic Capacitor[Digikey: 490-1691-2-ND] 10.0 µF 10V 10% Ceramic Capacitor[Digikey: 709-1228-1-ND] 10.0 uF 16V 10% Ceramic Capacitor [Digikey: 478-5165-2-ND] 47 uF 6.3V 20% Ceramic Capacitor [Digikey: 587-1779-1-ND or 399-5506-1-ND] 1206 - 1206 Surface Mount Capacitors 47uF 10V 20% Ceramic Capacitor [Digikey: 490-5528-1-ND or 399-5508-1-ND or 445-6010-1-ND] 100uF 6.3V -20%, +80% Y5V Ceramic Capacitor (Digikey: 490-4512-1-ND, Mouser: 81-GRM31CF50J107ZE1L) 1810 - 1810 Surface Mount Capacitors High volt MLC; no solder stop between for higher isolation; CLASS: CAPACITOR; DESCRIPTION: NO DESCRIPTION; LINK: UNKNOWN LINK; MANUFACTURER: UNKNOWN MANUFACTURER; MANUFACTURERPARTNUMBER: UNKNOWN MANUFACTURER PART NUMBER; POPULATED: TRUE; ROHSCERTIFICATE: UNKNOWN ROHS CERTIFICATE; SOURCE: UNKNOWN SOURCE; SOURCEPARTNUMBER: 311-1455-1-ND
D1 = laforge:PESD5V0UBV: NXP PESD5V0U5BV 5-channel bidirectional TVS array; CLASS: DIODE; DESCRIPTION: TVS DIODE 5V SOT666; LINK: https://www.digikey.de/product-detail/de/nexperia-usa-inc/PESD5V0U5BV,115/1727-5806-1-ND; MANUFACTURER: Nexperia USA Inc.; MANUFACTURERPARTNUMBER: PESD5V0U5BV,115; OC_DIGIKEY: 568-7356-1-ND; POPULATED: TRUE; ROHSCERTIFICATE: UNKNOWN ROHS CERTIFICATE; SOURCE: DIGIKEY; SOURCEPARTNUMBER: 1727-5806-1-ND
D2 = diodes-sysmocom:DIODE-SCHOTTKY: Diode SMA Model Volts Amps Type Vf Vr Digikey # Notes SSA34-E3 40V 3A Schottky 480mV @ 3A 200uA @ 40V SSA34-E3/61TGITR-ND CDBA120-G 20V 1A Schottky 500mV @ 1A 500uA @ 20V 641-1014-6-ND REEL MBRA210 10V 2A Schottky 350mV @ 2A 700uA @ 10V MBRA210LT3 SOD-123 Model Volts Amps Type Vf Vr Order # Notes BAT54T1G 30V 200mA Schottky 800mV @ 200mA 2uA @ 25V BAT54T1GOSTR-ND B0530W 30V 500mA Schottky 430mV @ 500mA 130uA @ 30V B0530W-FDICT-ND REEL MBR120 1A 20V Schottky 340mV @ 1A MBR120VLSFT1GOSCT-ND SOD-323 Model Volts Amps Type Vf Vr Order # Notes PMEG2005EJ 20V 500mA Schottky 355mV @ 500mA 568-4110-1-ND ZLLS410 10V 570mA Schottky 380mV @ 570mA ZLLS410CT-ND 1N4148WS 75V 150mA Silicon/Simple 1V 1N4148WSFSCT-ND REEL SOD-523 Model Volts Amps Type Vf Vr Order # Notes BAT54XV2 30V 200mA Schottky 0.8V @ 100mA BAT54XV2CT-ND TB751S 30V 30mA Schottky RB751S-40TE61CT-ND SOT23-R/W (R = Solder Paste/Reflow Ovens, W = Hand-Soldering) Model Volts Amps Type Vf Vr Order # Notes BAT54FILM 40V 300mA Schottky 497-7162-1-ND; CLASS: DIODE; DESCRIPTION: DIODE SCHOTTKY 40V 5A DO214AA; LINK: https://www.digikey.de/product-detail/de/comchip-technology/ACDBB540-HF/641-1898-2-ND; MANUFACTURER: Comchip Technology; MANUFACTURERPARTNUMBER: ACDBB540-HF; POPULATED: TRUE; ROHSCERTIFICATE: UNKNOWN ROHS CERTIFICATE; SOURCE: DIGIKEY; SOURCEPARTNUMBER: 641-1898-2-ND
D3 = diodes-sysmocom:DIODE-TVS; CLASS: DIODE; DESCRIPTION: TVS DIODE 5.8V 10.5V DO214AA; LINK: https://www.digikey.de/product-detail/de/micro-commercial-co/SMBJP6KE6.8A-TP/SMBJP6KE6.8A-TPMSCT-ND; MANUFACTURER: Micro Commercial Co; MANUFACTURERPARTNUMBER: SMBJP6KE6.8A-TP; POPULATED: TRUE; ROHSCERTIFICATE: Bleifrei / RoHS-konform; SOURCE: DIGIKEY; SOURCEPARTNUMBER: SMBJP6KE6.8A-TPMSCT-ND
D4 = diodes-sysmocom:TVSDIODE-BIDI: TVS diode, bi-directional ESD5V3S1B-02LRH, TPD1E10B06 ...; CLASS: DIODE; DESCRIPTION: TVS DIODE 5V 15.5V 0402; LINK: https://www.digikey.de/product-detail/de/avx-corporation/GG0402050R3C2P/478-10591-1-ND; MANUFACTURER: AVX Corporation; MANUFACTURERPARTNUMBER: GG0402050R3C2P; POPULATED: TRUE; ROHSCERTIFICATE: UNKNOWN ROHS CERTIFICATE; SOURCE: DIGIKEY; SOURCEPARTNUMBER: 478-10591-1-ND
IC1 = laforge:SN74AVC4T245: IC @VQFN16: exp pad float or GND; CLASS: IC; DESCRIPTION: NO DESCRIPTION; LINK: UNKNOWN LINK; MANUFACTURER: UNKNOWN MANUFACTURER; MANUFACTURERPARTNUMBER: UNKNOWN MANUFACTURER PART NUMBER; POPULATED: TRUE; ROHSCERTIFICATE: UNKNOWN ROHS CERTIFICATE; SOURCE: UNKNOWN SOURCE; SOURCEPARTNUMBER: 296-18231-1-ND
IC2 = NAU8810:NAU88C10: NAU88C10 Mono Audio Codec with 2-wire Control Interface; CLASS: UNKNOWN CLASS; DESCRIPTION: NO DESCRIPTION; LINK: UNKNOWN LINK; MANUFACTURER: UNKNOWN MANUFACTURER; MANUFACTURERPARTNUMBER: UNKNOWN MANUFACTURER PART NUMBER; POPULATED: TRUE; ROHSCERTIFICATE: UNKNOWN ROHS CERTIFICATE; SOURCE: UNKNOWN SOURCE; SOURCEPARTNUMBER: UNKNOWN SOURCE PART NUMBER
IC3 = TXB0102:TXB0102: 2-Bit Bidirectional Voltage-Level Translator With Auto Direction Sensing and ±15-kV ESD Protection 1.2 V to 3.6 V on A Port and 1.65 V to 5.5 V On B Port (VCCA ≤ VCCB); CLASS: UNKNOWN CLASS; DESCRIPTION: NO DESCRIPTION; LINK: UNKNOWN LINK; MANUFACTURER: UNKNOWN MANUFACTURER; MANUFACTURERPARTNUMBER: UNKNOWN MANUFACTURER PART NUMBER; POPULATED: TRUE; ROHSCERTIFICATE: UNKNOWN ROHS CERTIFICATE; SOURCE: UNKNOWN SOURCE; SOURCEPARTNUMBER: 296-22862-1-ND
J1 = SparkFun-Connectors:AUDIO-JACK3: Audio jack - 3.5mm TRRS variety - two rings.; CLASS: CONNECTOR; DESCRIPTION: AUDIO JACK, 3.5 MM, RT, 4 CONDUC; LINK: https://www.digikey.de/product-detail/de/cui-devices/SJ2-3574A-SMT-TR/CP-SJ2-3574A-SMT-CT-ND; MANUFACTURER: CUI Devices; MANUFACTURERPARTNUMBER: SJ2-3574A-SMT-TR; POPULATED: TRUE; ROHSCERTIFICATE: UNKNOWN ROHS CERTIFICATE; SOURCE: DIGIKEY; SOURCEPARTNUMBER: CP-SJ2-3574A-SMT-CT-ND
JP1 = jumper:JP1E: JUMPER; CLASS: CONNECTOR\JUMPER; DESCRIPTION: NO DESCRIPTION; LINK: UNKNOWN LINK; MANUFACTURER: UNKNOWN MANUFACTURER; MANUFACTURERPARTNUMBER: UNKNOWN MANUFACTURER PART NUMBER; POPULATED: TRUE; ROHSCERTIFICATE: UNKNOWN ROHS CERTIFICATE; SOURCE: UNKNOWN SOURCE; SOURCEPARTNUMBER: UNKNOWN SOURCE PART NUMBER
JP2 = jumper:JP2E: JUMPER; CLASS: CONNECTOR\JUMPER; DESCRIPTION: NO DESCRIPTION; LINK: UNKNOWN LINK; MANUFACTURER: UNKNOWN MANUFACTURER; MANUFACTURERPARTNUMBER: UNKNOWN MANUFACTURER PART NUMBER; POPULATED: TRUE; ROHSCERTIFICATE: UNKNOWN ROHS CERTIFICATE; SOURCE: UNKNOWN SOURCE; SOURCEPARTNUMBER: UNKNOWN SOURCE PART NUMBER
JP3 = microbuilder:HEADER-1X4: PIN HEADER; CLASS: CONNECTOR\JUMPER; DESCRIPTION: NO DESCRIPTION; LINK: UNKNOWN LINK; MANUFACTURER: UNKNOWN MANUFACTURER; MANUFACTURERPARTNUMBER: UNKNOWN MANUFACTURER PART NUMBER; POPULATED: TRUE; ROHSCERTIFICATE: UNKNOWN ROHS CERTIFICATE; SOURCE: UNKNOWN SOURCE; SOURCEPARTNUMBER: UNKNOWN SOURCE PART NUMBER
K1 = Wurth_Elektronik_Electromechanic_DC_Power_Jack_Connectors_rev15c:694108106102: WR-DC_DC Power Jack_Right Angled_SMT Center Pin Ø2.5_Plug ID Ø2.55_Plug OD Ø5.5_with 4 Soldering Pad & Peg ;=>Code : Con_WR-DC_SMT_694108106102_694108106102 <http://katalog.we-online.de/media/images/eican/Con_WR-DC_SMT_694108106102_pf2.jpg> Details see: http://katalog.we-online.de/em/datasheet/6941xx106102.pdf Created 2014-10-08, Karrer Zheng 2014 (C) Wurth Elektronik; CLASS: CONNECTOR; DESCRIPTION: CONN PWR JACK 2.5X5.5MM SOLDER; LINK: https://www.digikey.de/product-detail/de/cui-inc/PJ-002BH-SMT-TR/CP-002BHPJCT-ND; MANUFACTURER: CUI Devices; MANUFACTURERPARTNUMBER: PJ-002BH-SMT-TR; POPULATED: TRUE; ROHSCERTIFICATE: UNKNOWN ROHS CERTIFICATE; SOURCE: DIGIKEY; SOURCEPARTNUMBER: CP-002BHPJCT-ND
L1 L2 = rc-sysmocom:INDUCTOR; CLASS: INDUCTOR; DESCRIPTION: NO DESCRIPTION; LINK: UNKNOWN LINK; MANUFACTURER: UNKNOWN MANUFACTURER; MANUFACTURERPARTNUMBER: UNKNOWN MANUFACTURER PART NUMBER; POPULATED: TRUE; ROHSCERTIFICATE: UNKNOWN ROHS CERTIFICATE; SOURCE: UNKNOWN SOURCE; SOURCEPARTNUMBER: UNKNOWN SOURCE PART NUMBER
LED1 LED2 = led:LED: LED OSRAM: - CHIPLED LG R971, LG N971, LY N971, LG Q971, LY Q971, LO R971, LY R971 LH N974, LH R974 LS Q976, LO Q976, LY Q976 LO Q996 - Hyper CHIPLED LW Q18S LB Q993, LB Q99A, LB R99A - SideLED LS A670, LO A670, LY A670, LG A670, LP A670 LB A673, LV A673, LT A673, LW A673 LH A674 LY A675 LS A676, LA A676, LO A676, LY A676, LW A676 LS A679, LY A679, LG A679 - Hyper Micro SIDELED® LS Y876, LA Y876, LO Y876, LY Y876 LT Y87S - SmartLED LW L88C, LW L88S LB L89C, LB L89S, LG L890 LS L89K, LO L89K, LY L89K LS L896, LA L896, LO L896, LY L896 - TOPLED LS T670, LO T670, LY T670, LG T670, LP T670 LSG T670, LSP T670, LSY T670, LOP T670, LYG T670 LG T671, LOG T671, LSG T671 LB T673, LV T673, LT T673, LW T673 LH T674 LS T676, LA T676, LO T676, LY T676, LB T676, LH T676, LSB T676, LW T676 LB T67C, LV T67C, LT T67C, LS T67K, LO T67K, LY T67K, LW E67C LS E67B, LA E67B, LO E67B, LY E67B, LB E67C, LV E67C, LT E67C LW T67C LS T679, LY T679, LG T679 LS T770, LO T770, LY T770, LG T770, LP T770 LB T773, LV T773, LT T773, LW T773 LH T774 LS E675, LA E675, LY E675, LS T675 LS T776, LA T776, LO T776, LY T776, LB T776 LHGB T686 LT T68C, LB T68C - Hyper Mini TOPLED® LB M676 - Mini TOPLED Santana® LG M470 LS M47K, LO M47K, LY M47K Source: http://www.osram.convergy.de LUXEON: - LUMILED® LXK2-PW12-R00, LXK2-PW12-S00, LXK2-PW14-U00, LXK2-PW14-V00 LXK2-PM12-R00, LXK2-PM12-S00, LXK2-PM14-U00 LXK2-PE12-Q00, LXK2-PE12-R00, LXK2-PE12-S00, LXK2-PE14-T00, LXK2-PE14-U00 LXK2-PB12-K00, LXK2-PB12-L00, LXK2-PB12-M00, LXK2-PB14-N00, LXK2-PB14-P00, LXK2-PB14-Q00 LXK2-PR12-L00, LXK2-PR12-M00, LXK2-PR14-Q00, LXK2-PR14-R00 LXK2-PD12-Q00, LXK2-PD12-R00, LXK2-PD12-S00 LXK2-PH12-R00, LXK2-PH12-S00 LXK2-PL12-P00, LXK2-PL12-Q00, LXK2-PL12-R00 Source: www.luxeon.com KINGBRIGHT: KA-3528ASYC Source: www.kingbright.com; CLASS: LED; DESCRIPTION: NO DESCRIPTION; LINK: UNKNOWN LINK; MANUFACTURER: UNKNOWN MANUFACTURER; MANUFACTURERPARTNUMBER: UNKNOWN MANUFACTURER PART NUMBER; POPULATED: TRUE; ROHSCERTIFICATE: UNKNOWN ROHS CERTIFICATE; SOURCE: UNKNOWN SOURCE; SOURCEPARTNUMBER: UNKNOWN SOURCE PART NUMBER
MDM1 = GTM900:GTM900-B; CLASS: UNKNOWN CLASS; DESCRIPTION: NO DESCRIPTION; LINK: UNKNOWN LINK; MANUFACTURER: UNKNOWN MANUFACTURER; MANUFACTURERPARTNUMBER: UNKNOWN MANUFACTURER PART NUMBER; POPULATED: TRUE; ROHSCERTIFICATE: UNKNOWN ROHS CERTIFICATE; SOURCE: UNKNOWN SOURCE; SOURCEPARTNUMBER: UNKNOWN SOURCE PART NUMBER
R1 = rc-sysmocom:RESISTOR: Resistors 0402 - 0402 Surface Mount Package 22 Ohm 1% 1/16W [Digikey: 311-22.0LRTR-ND] 33 Ohm 5% 1/16W 1.0K 5% 1/16W 1.5K 5% 1/16W 2.0K 1% 1/16W 10.0K 1% 1/16W [Digikey: 311-10.0KLRTR-ND] 10.0K 5% 1/16W [Digikey: RMCF0402JT10K0TR-ND] 12.1K 1% 1/16W [Digikey: 311-22.0LRTR-ND] 100.0K 5% 1/16W 0603 - 0603 Surface Mount Package 1/10 Watt 0805 - 0805 Surface Mount Package 1/8 Watt 1206 - 1206 Surface Mount Package 2012 - 2010 Surface Mount Package 0.11 Ohm 1/2 Watt 1% Resistor - Digikey: RHM.11UCT-ND; CLASS: RESISTOR; DESCRIPTION: RES SMD 15K OHM 1%% 1/10W 0603; LINK: https://www.digikey.de/product-detail/de/yageo/RC0603FR-0715KL/311-15.0KHRCT-ND; MANUFACTURER: Yageo; MANUFACTURERPARTNUMBER: RC0603FR-0715KL; POPULATED: TRUE; ROHSCERTIFICATE: UNKNOWN ROHS CERTIFICATE; SOURCE: DIGIKEY; SOURCEPARTNUMBER: 311-15.0KHRCT-ND
R2 R3 = rc-sysmocom:RESISTOR: Resistors 0402 - 0402 Surface Mount Package 22 Ohm 1% 1/16W [Digikey: 311-22.0LRTR-ND] 33 Ohm 5% 1/16W 1.0K 5% 1/16W 1.5K 5% 1/16W 2.0K 1% 1/16W 10.0K 1% 1/16W [Digikey: 311-10.0KLRTR-ND] 10.0K 5% 1/16W [Digikey: RMCF0402JT10K0TR-ND] 12.1K 1% 1/16W [Digikey: 311-22.0LRTR-ND] 100.0K 5% 1/16W 0603 - 0603 Surface Mount Package 1/10 Watt 0805 - 0805 Surface Mount Package 1/8 Watt 1206 - 1206 Surface Mount Package 2012 - 2010 Surface Mount Package 0.11 Ohm 1/2 Watt 1% Resistor - Digikey: RHM.11UCT-ND; CLASS: RESISTOR; DESCRIPTION: RES SMD 47 OHM 5%% 1/10W 0603; LINK: http://www.digikey.de/product-detail/de/yageo/RC0603JR-0747RL/311-47GRCT-ND/729740; MANUFACTURER: Yageo; MANUFACTURERPARTNUMBER: RC0603JR-0747RL; POPULATED: TRUE; ROHSCERTIFICATE: UNKNOWN ROHS CERTIFICATE; SOURCE: DIGIKEY; SOURCEPARTNUMBER: 311-47GRCT-ND
R4 R8 = rc-sysmocom:RESISTOR: Resistors 0402 - 0402 Surface Mount Package 22 Ohm 1% 1/16W [Digikey: 311-22.0LRTR-ND] 33 Ohm 5% 1/16W 1.0K 5% 1/16W 1.5K 5% 1/16W 2.0K 1% 1/16W 10.0K 1% 1/16W [Digikey: 311-10.0KLRTR-ND] 10.0K 5% 1/16W [Digikey: RMCF0402JT10K0TR-ND] 12.1K 1% 1/16W [Digikey: 311-22.0LRTR-ND] 100.0K 5% 1/16W 0603 - 0603 Surface Mount Package 1/10 Watt 0805 - 0805 Surface Mount Package 1/8 Watt 1206 - 1206 Surface Mount Package 2012 - 2010 Surface Mount Package 0.11 Ohm 1/2 Watt 1% Resistor - Digikey: RHM.11UCT-ND; CLASS: RESISTOR; DESCRIPTION: RES SMD 4.7K OHM 5%% 1/10W 0603; LINK: http://www.digikey.de/product-detail/de/yageo/RC0603JR-074K7L/311-4.7KGRCT-ND/729732; MANUFACTURER: Yageo; MANUFACTURERPARTNUMBER: RC0603JR-074K7L; POPULATED: TRUE; ROHSCERTIFICATE: UNKNOWN ROHS CERTIFICATE; SOURCE: DIGIKEY; SOURCEPARTNUMBER: 311-4.7KGRCT-ND
R5 = rc-sysmocom:RESISTOR: Resistors 0402 - 0402 Surface Mount Package 22 Ohm 1% 1/16W [Digikey: 311-22.0LRTR-ND] 33 Ohm 5% 1/16W 1.0K 5% 1/16W 1.5K 5% 1/16W 2.0K 1% 1/16W 10.0K 1% 1/16W [Digikey: 311-10.0KLRTR-ND] 10.0K 5% 1/16W [Digikey: RMCF0402JT10K0TR-ND] 12.1K 1% 1/16W [Digikey: 311-22.0LRTR-ND] 100.0K 5% 1/16W 0603 - 0603 Surface Mount Package 1/10 Watt 0805 - 0805 Surface Mount Package 1/8 Watt 1206 - 1206 Surface Mount Package 2012 - 2010 Surface Mount Package 0.11 Ohm 1/2 Watt 1% Resistor - Digikey: RHM.11UCT-ND; CLASS: RESISTOR; DESCRIPTION: RES SMD 47K OHM 1%% 1/10W 0603; LINK: https://www.digikey.de/product-detail/de/yageo/RC0603FR-0747KL/311-47-0KHRCT-ND/730200; MANUFACTURER: Yageo; MANUFACTURERPARTNUMBER: RC0603FR-0747KL; POPULATED: TRUE; ROHSCERTIFICATE: UNKNOWN ROHS CERTIFICATE; SOURCE: DIGIKEY; SOURCEPARTNUMBER: 311-47.0KHRCT-ND
R6 R7 R12 R14 R15 R20 R29 = rc-sysmocom:RESISTOR: Resistors 0402 - 0402 Surface Mount Package 22 Ohm 1% 1/16W [Digikey: 311-22.0LRTR-ND] 33 Ohm 5% 1/16W 1.0K 5% 1/16W 1.5K 5% 1/16W 2.0K 1% 1/16W 10.0K 1% 1/16W [Digikey: 311-10.0KLRTR-ND] 10.0K 5% 1/16W [Digikey: RMCF0402JT10K0TR-ND] 12.1K 1% 1/16W [Digikey: 311-22.0LRTR-ND] 100.0K 5% 1/16W 0603 - 0603 Surface Mount Package 1/10 Watt 0805 - 0805 Surface Mount Package 1/8 Watt 1206 - 1206 Surface Mount Package 2012 - 2010 Surface Mount Package 0.11 Ohm 1/2 Watt 1% Resistor - Digikey: RHM.11UCT-ND; CLASS: RESISTOR; DESCRIPTION: RES SMD 22K OHM 1%% 1/10W 0603; LINK: https://www.digikey.de/product-detail/de/yageo/RC0603FR-0722KL/311-22-0KHRCT-ND/730003; MANUFACTURER: Yageo; MANUFACTURERPARTNUMBER: RC0603FR-0722KL; POPULATED: TRUE; ROHSCERTIFICATE: UNKNOWN ROHS CERTIFICATE; SOURCE: DIGIKEY; SOURCEPARTNUMBER: 311-22.0KHRCT-ND
R9 R13 = rc-sysmocom:RESISTOR: Resistors 0402 - 0402 Surface Mount Package 22 Ohm 1% 1/16W [Digikey: 311-22.0LRTR-ND] 33 Ohm 5% 1/16W 1.0K 5% 1/16W 1.5K 5% 1/16W 2.0K 1% 1/16W 10.0K 1% 1/16W [Digikey: 311-10.0KLRTR-ND] 10.0K 5% 1/16W [Digikey: RMCF0402JT10K0TR-ND] 12.1K 1% 1/16W [Digikey: 311-22.0LRTR-ND] 100.0K 5% 1/16W 0603 - 0603 Surface Mount Package 1/10 Watt 0805 - 0805 Surface Mount Package 1/8 Watt 1206 - 1206 Surface Mount Package 2012 - 2010 Surface Mount Package 0.11 Ohm 1/2 Watt 1% Resistor - Digikey: RHM.11UCT-ND; CLASS: RESISTOR; DESCRIPTION: RES SMD 1K OHM 0.5%% 1/16W 0603; LINK: https://www.digikey.de/product-detail/de/susumu/RR0816P-102-D/RR08P1-0KDCT-ND/432724; MANUFACTURER: Susumu; MANUFACTURERPARTNUMBER: RR0816P-102-D; POPULATED: TRUE; ROHSCERTIFICATE: UNKNOWN ROHS CERTIFICATE; SOURCE: DIGIKEY; SOURCEPARTNUMBER: RR08P1.0KDCT-ND
R10 R16 = rc-sysmocom:RESISTOR: Resistors 0402 - 0402 Surface Mount Package 22 Ohm 1% 1/16W [Digikey: 311-22.0LRTR-ND] 33 Ohm 5% 1/16W 1.0K 5% 1/16W 1.5K 5% 1/16W 2.0K 1% 1/16W 10.0K 1% 1/16W [Digikey: 311-10.0KLRTR-ND] 10.0K 5% 1/16W [Digikey: RMCF0402JT10K0TR-ND] 12.1K 1% 1/16W [Digikey: 311-22.0LRTR-ND] 100.0K 5% 1/16W 0603 - 0603 Surface Mount Package 1/10 Watt 0805 - 0805 Surface Mount Package 1/8 Watt 1206 - 1206 Surface Mount Package 2012 - 2010 Surface Mount Package 0.11 Ohm 1/2 Watt 1% Resistor - Digikey: RHM.11UCT-ND; CLASS: RESISTOR; DESCRIPTION: RES SMD 330 OHM 5%% 1/10W 0603; LINK: http://www.digikey.de/product-detail/de/yageo/RC0603JR-07330RL/311-330GRCT-ND/729716; MANUFACTURER: Yageo; MANUFACTURERPARTNUMBER: RC0603JR-07330RL; POPULATED: TRUE; ROHSCERTIFICATE: UNKNOWN ROHS CERTIFICATE; SOURCE: DIGIKEY; SOURCEPARTNUMBER: 311-330GRCT-ND
R11 = rc-sysmocom:RESISTOR: Resistors 0402 - 0402 Surface Mount Package 22 Ohm 1% 1/16W [Digikey: 311-22.0LRTR-ND] 33 Ohm 5% 1/16W 1.0K 5% 1/16W 1.5K 5% 1/16W 2.0K 1% 1/16W 10.0K 1% 1/16W [Digikey: 311-10.0KLRTR-ND] 10.0K 5% 1/16W [Digikey: RMCF0402JT10K0TR-ND] 12.1K 1% 1/16W [Digikey: 311-22.0LRTR-ND] 100.0K 5% 1/16W 0603 - 0603 Surface Mount Package 1/10 Watt 0805 - 0805 Surface Mount Package 1/8 Watt 1206 - 1206 Surface Mount Package 2012 - 2010 Surface Mount Package 0.11 Ohm 1/2 Watt 1% Resistor - Digikey: RHM.11UCT-ND; CLASS: RESISTOR; DESCRIPTION: RES 200K OHM 1/16W 1% 0603; LINK: http://www.digikey.de/product-detail/de/8-1879338-5/A102235CT-ND/2728211; MANUFACTURER: TE Connectivity; MANUFACTURERPARTNUMBER: 8-1879338-5; POPULATED: TRUE; ROHSCERTIFICATE: Bleifrei / RoHS-konform; SOURCE: DIGIKEY; SOURCEPARTNUMBER: A102235CT-ND
R17 R31 R32 = rc-sysmocom:RESISTOR: Resistors 0402 - 0402 Surface Mount Package 22 Ohm 1% 1/16W [Digikey: 311-22.0LRTR-ND] 33 Ohm 5% 1/16W 1.0K 5% 1/16W 1.5K 5% 1/16W 2.0K 1% 1/16W 10.0K 1% 1/16W [Digikey: 311-10.0KLRTR-ND] 10.0K 5% 1/16W [Digikey: RMCF0402JT10K0TR-ND] 12.1K 1% 1/16W [Digikey: 311-22.0LRTR-ND] 100.0K 5% 1/16W 0603 - 0603 Surface Mount Package 1/10 Watt 0805 - 0805 Surface Mount Package 1/8 Watt 1206 - 1206 Surface Mount Package 2012 - 2010 Surface Mount Package 0.11 Ohm 1/2 Watt 1% Resistor - Digikey: RHM.11UCT-ND; CLASS: RESISTOR; DESCRIPTION: RES 0 OHM JUMPER 1/16W 0402; LINK: https://www.digikey.de/product-detail/de/stackpole-electronics-inc/RMCF0402ZT0R00/RMCF0402ZT0R00CT-ND; MANUFACTURER: Stackpole Electronics Inc; MANUFACTURERPARTNUMBER: RMCF0402ZT0R00; POPULATED: TRUE; ROHSCERTIFICATE: UNKNOWN ROHS CERTIFICATE; SOURCE: DIGIKEY; SOURCEPARTNUMBER: RMCF0402ZT0R00CT-ND
R18 R19 R21-R28 R30 = rc-sysmocom:RESISTOR: Resistors 0402 - 0402 Surface Mount Package 22 Ohm 1% 1/16W [Digikey: 311-22.0LRTR-ND] 33 Ohm 5% 1/16W 1.0K 5% 1/16W 1.5K 5% 1/16W 2.0K 1% 1/16W 10.0K 1% 1/16W [Digikey: 311-10.0KLRTR-ND] 10.0K 5% 1/16W [Digikey: RMCF0402JT10K0TR-ND] 12.1K 1% 1/16W [Digikey: 311-22.0LRTR-ND] 100.0K 5% 1/16W 0603 - 0603 Surface Mount Package 1/10 Watt 0805 - 0805 Surface Mount Package 1/8 Watt 1206 - 1206 Surface Mount Package 2012 - 2010 Surface Mount Package 0.11 Ohm 1/2 Watt 1% Resistor - Digikey: RHM.11UCT-ND; CLASS: RESISTOR; DESCRIPTION: NO DESCRIPTION; LINK: UNKNOWN LINK; MANUFACTURER: UNKNOWN MANUFACTURER; MANUFACTURERPARTNUMBER: UNKNOWN MANUFACTURER PART NUMBER; POPULATED: TRUE; ROHSCERTIFICATE: UNKNOWN ROHS CERTIFICATE; SOURCE: UNKNOWN SOURCE; SOURCEPARTNUMBER: UNKNOWN SOURCE PART NUMBER
SIM1 = SF7W008S1A-SIM:SF7W008S1A: JAE SIM card holder with lock and card detect switch; CLASS: UNKNOWN CLASS; DESCRIPTION: CONN SIM CARD HINGED TYPE R/A; LINK: https://www.digikey.de/product-detail/de/jae-electronics/SF7W008S1AR900/670-2985-1-ND; MANUFACTURER: JAE Electronics; MANUFACTURERPARTNUMBER: SF7W008S1AR900; OC_DIGIKEY: 670-2985-1-ND; POPULATED: TRUE; ROHSCERTIFICATE: UNKNOWN ROHS CERTIFICATE; SOURCE: DIGIKEY; SOURCEPARTNUMBER: 670-2985-1-ND
T1 T2 = transistor:*-NPN-: NPN Transistror BF959 corrected 2008.03.06; CLASS: TRANSISTOR; DESCRIPTION: TRANS NPN 45V 0.1A SOT23; LINK: https://www.digikey.de/product-detail/de/nexperia-usa-inc/BC847C,215/1727-2924-1-ND; MANUFACTURER: Nexperia USA Inc.; MANUFACTURERPARTNUMBER: BC847C,215; POPULATED: TRUE; ROHSCERTIFICATE: UNKNOWN ROHS CERTIFICATE; SOURCE: DIGIKEY; SOURCEPARTNUMBER: 1727-2924-1-ND
TP1-TP10 = testpad:TP: Test pad; CLASS: UNKNOWN CLASS; DESCRIPTION: NO DESCRIPTION; LINK: UNKNOWN LINK; MANUFACTURER: UNKNOWN MANUFACTURER; MANUFACTURERPARTNUMBER: UNKNOWN MANUFACTURER PART NUMBER; POPULATED: FALSE; ROHSCERTIFICATE: UNKNOWN ROHS CERTIFICATE; SOURCE: UNKNOWN SOURCE; SOURCEPARTNUMBER: UNKNOWN SOURCE PART NUMBER
U1 = FH12A-40S-0.5SH(55):FH12A-40S-0.5SH(55); CLASS: CONNECTOR; DESCRIPTION: CONN FFC TOP 40POS 0.50MM R/A; LINK: https://www.digikey.de/product-detail/de/hirose-electric-co-ltd/FH12A-40S-0-5SH-55/HFK140CT-ND/; MANUFACTURER: Hirose Electric Co Ltd; MANUFACTURERPARTNUMBER: FH12A-40S-0.5SH(55); MPN: FH12A-40S-0.5SH(55); OC_FARNELL: 1324569; OC_NEWARK: 34M6194; PACKAGE: SOCKET FFC/FPC, ZIF, 0.5MM, 40WAY; POPULATED: TRUE; ROHSCERTIFICATE: UNKNOWN ROHS CERTIFICATE; SOURCE: DIGIKEY; SOURCEPARTNUMBER: HFK140CT-ND; SUPPLIER: Hirose
U2 = ldo:LDO_FIXED_EN: High-Performance Single 150mA LDO; CLASS: IC; DESCRIPTION: IC REG LINEAR 2.8V 150MA SC70-5; LINK: https://www.digikey.de/product-detail/de/microchip-technology/MIC5366-2-8YC5-TR/576-3209-1-ND; MANUFACTURER: Microchip Technology; MANUFACTURERPARTNUMBER: MIC5366-2.8YC5-TR; POPULATED: TRUE; ROHSCERTIFICATE: UNKNOWN ROHS CERTIFICATE; SOURCE: DIGIKEY; SOURCEPARTNUMBER: 576-3209-1-ND
U3 = ldo:LDO_SHD_ADJ: 1000mA LDO MCP1827: 1500 mA; CLASS: IC; DESCRIPTION: IC REG LIN POS ADJ 1.5A 5DDPAK; LINK: https://www.digikey.de/product-detail/de/microchip-technology/MCP1827T-ADJE-ET/MCP1827T-ADJE-ETCT-ND/8538072; MANUFACTURER: Microchip Technology; MANUFACTURERPARTNUMBER: MCP1827T-ADJE/ET; POPULATED: TRUE; ROHSCERTIFICATE: UNKNOWN ROHS CERTIFICATE; SOURCE: DIGIKEY; SOURCEPARTNUMBER: MCP1827T-ADJE/ETCT-ND
U4 = RpiPico:RASPBERRY_PICO: Raspberry Pi Pico; CLASS: IC; DESCRIPTION: NO DESCRIPTION; LINK: https://www.digikey.de/en/products/detail/raspberry-pi/SC0915/13624793; MANUFACTURER: UNKNOWN MANUFACTURER; MANUFACTURERPARTNUMBER: UNKNOWN MANUFACTURER PART NUMBER; POPULATED: TRUE; ROHSCERTIFICATE: UNKNOWN ROHS CERTIFICATE; SOURCE: UNKNOWN SOURCE; SOURCEPARTNUMBER: 2648-SC0915CT-ND
X1 = laforge:PINHD-1X3: Header 3 Standard 3-pin 0.1" header; CLASS: CONNECTOR; DESCRIPTION: NO DESCRIPTION; LINK: UNKNOWN LINK; MANUFACTURER: UNKNOWN MANUFACTURER; MANUFACTURERPARTNUMBER: UNKNOWN MANUFACTURER PART NUMBER; POPULATED: TRUE; ROHSCERTIFICATE: UNKNOWN ROHS CERTIFICATE; SOURCE: UNKNOWN SOURCE; SOURCEPARTNUMBER: UNKNOWN SOURCE PART NUMBER
X2 = laforge:SMA-F; CLASS: CONNECTOR; DESCRIPTION: CONN SMA JACK STR 50 OHM PCB; LINK: http://www.digikey.de/product-detail/de/te-connectivity-amp-connectors/5-1814832-1/A97594-ND/1755982; MANUFACTURER: TE Connectivity AMP Connectors; MANUFACTURERPARTNUMBER: 5-1814832-1; POPULATED: TRUE; ROHSCERTIFICATE: UNKNOWN ROHS CERTIFICATE; SOURCE: DIGIKEY; SOURCEPARTNUMBER: A97594-ND
X3 = laforge:HRS_UFL: Hirose U.FL SMT; CLASS: CONNECTOR; DESCRIPTION: CONN U.FL RCPT STR 50 OHM SMD; LINK: http://www.digikey.de/product-detail/de/hirose-electric-co-ltd/U.FL-R-SMT(01)/H9161-ND/513010; MANUFACTURER: Hirose Electric Co Ltd; MANUFACTURERPARTNUMBER: U.FL-R-SMT(01); OC_DIGIKEY: H9161CT-ND; POPULATED: TRUE; ROHSCERTIFICATE: UNKNOWN ROHS CERTIFICATE; SOURCE: DIGIKEY; SOURCEPARTNUMBER: H9161-ND

## Net classes
1 usb: width 0.5 mm, drill 0.15 mm
2 50 ohm: width 0.9 mm, clearance 0.152 mm
3 supply: width 0.6 mm, clearance 0.203 mm